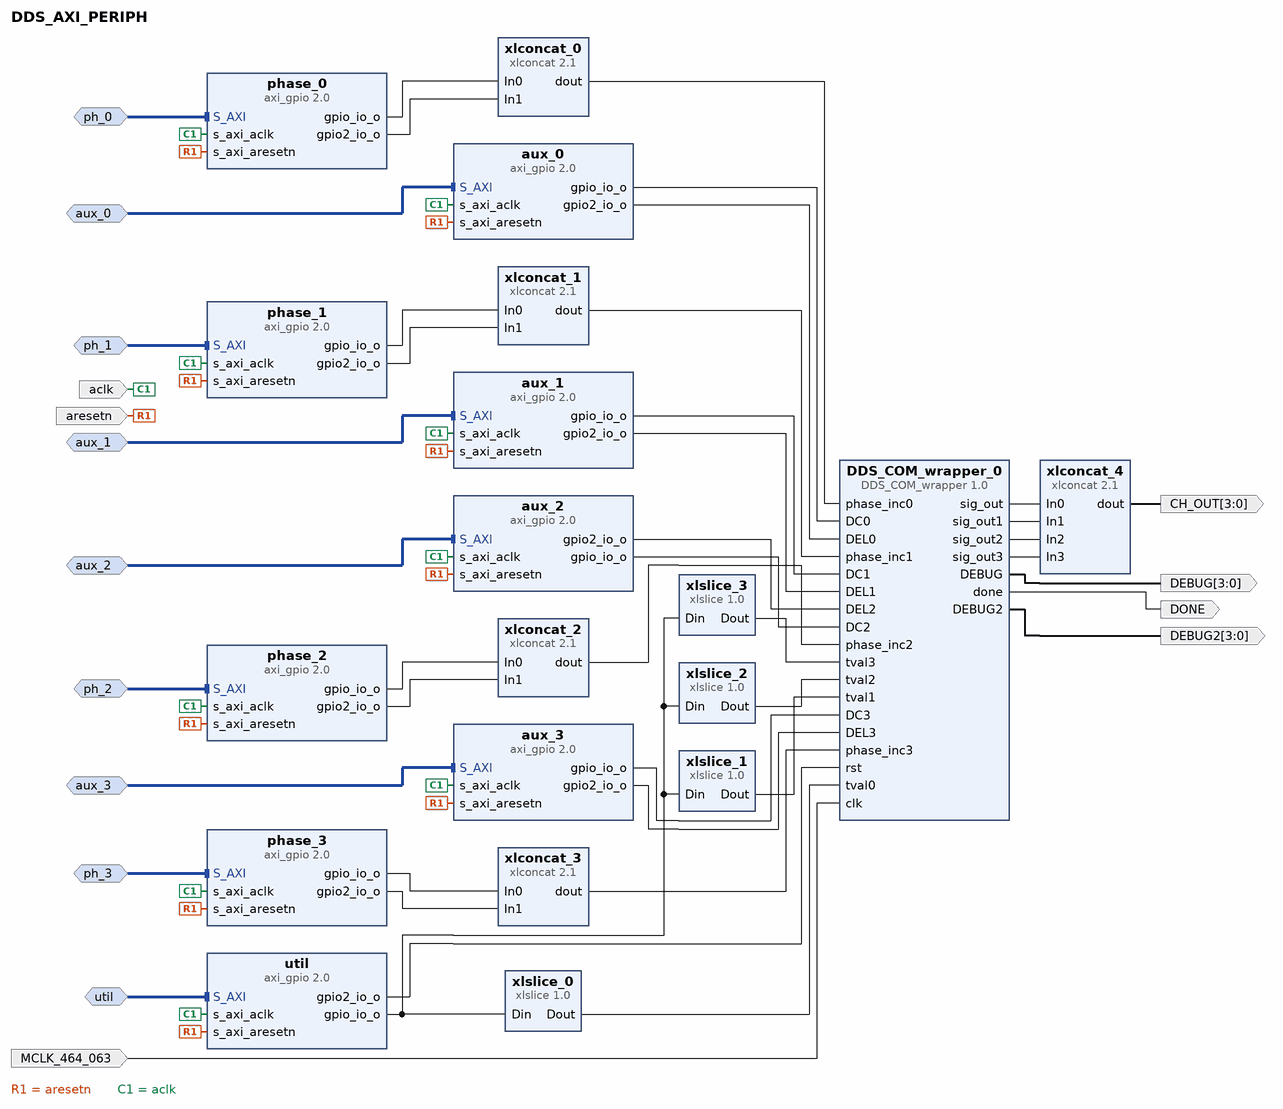
[diagram p0: block diagram of the top level]
# Vivado block design DDS_AXI_PERIPH, xc7z020clg400-1, Vivado 2019.1
create_bd_design DDS_AXI_PERIPH

create_bd_intf_port -mode Slave -vlnv xilinx.com:interface:aximm_tlm:1.0 ph_0
create_bd_intf_port -mode Slave -vlnv xilinx.com:interface:aximm_tlm:1.0 ph_1
create_bd_intf_port -mode Slave -vlnv xilinx.com:interface:aximm_tlm:1.0 ph_2
create_bd_intf_port -mode Slave -vlnv xilinx.com:interface:aximm_tlm:1.0 ph_3
create_bd_intf_port -mode Slave -vlnv xilinx.com:interface:aximm_tlm:1.0 aux_0
create_bd_intf_port -mode Slave -vlnv xilinx.com:interface:aximm_tlm:1.0 aux_1
create_bd_intf_port -mode Slave -vlnv xilinx.com:interface:aximm_tlm:1.0 aux_2
create_bd_intf_port -mode Slave -vlnv xilinx.com:interface:aximm_tlm:1.0 aux_3
create_bd_intf_port -mode Slave -vlnv xilinx.com:interface:aximm_tlm:1.0 util
create_bd_port -dir O -from 3 -to 0 CH_OUT
create_bd_port -dir O DONE
create_bd_port -dir I aresetn
create_bd_port -dir I MCLK_464_063
create_bd_port -dir I aclk
create_bd_port -dir O -from 3 -to 0 DEBUG
create_bd_port -dir O -from 3 -to 0 DEBUG2

create_bd_cell -type ip -vlnv xilinx.com:ip:axi_gpio:2.0 phase_0
set_property -dict [list \
  CONFIG.C_ALL_OUTPUTS 1 \
  CONFIG.C_ALL_OUTPUTS_2 1 \
  CONFIG.C_GPIO2_WIDTH 16 \
  CONFIG.C_IS_DUAL 1 \
] [get_bd_cells phase_0]
create_bd_cell -type ip -vlnv xilinx.com:ip:axi_gpio:2.0 phase_1
set_property -dict [list \
  CONFIG.C_ALL_OUTPUTS 1 \
  CONFIG.C_ALL_OUTPUTS_2 1 \
  CONFIG.C_GPIO2_WIDTH 16 \
  CONFIG.C_IS_DUAL 1 \
] [get_bd_cells phase_1]
create_bd_cell -type ip -vlnv xilinx.com:ip:axi_gpio:2.0 phase_2
set_property -dict [list \
  CONFIG.C_ALL_OUTPUTS 1 \
  CONFIG.C_ALL_OUTPUTS_2 1 \
  CONFIG.C_GPIO2_WIDTH 16 \
  CONFIG.C_IS_DUAL 1 \
] [get_bd_cells phase_2]
create_bd_cell -type ip -vlnv xilinx.com:ip:axi_gpio:2.0 phase_3
set_property -dict [list \
  CONFIG.C_ALL_OUTPUTS 1 \
  CONFIG.C_ALL_OUTPUTS_2 1 \
  CONFIG.C_GPIO2_WIDTH 16 \
  CONFIG.C_IS_DUAL 1 \
] [get_bd_cells phase_3]
create_bd_cell -type ip -vlnv xilinx.com:ip:xlconcat:2.1 xlconcat_0
set_property -dict {CONFIG.IN0_WIDTH 32 CONFIG.IN1_WIDTH 16} [get_bd_cells xlconcat_0]
create_bd_cell -type ip -vlnv xilinx.com:ip:xlconcat:2.1 xlconcat_1
set_property -dict {CONFIG.IN0_WIDTH 32 CONFIG.IN1_WIDTH 16} [get_bd_cells xlconcat_1]
create_bd_cell -type ip -vlnv xilinx.com:ip:xlconcat:2.1 xlconcat_2
set_property -dict {CONFIG.IN0_WIDTH 32 CONFIG.IN1_WIDTH 16} [get_bd_cells xlconcat_2]
create_bd_cell -type ip -vlnv xilinx.com:ip:xlconcat:2.1 xlconcat_3
set_property -dict {CONFIG.IN0_WIDTH 32 CONFIG.IN1_WIDTH 16} [get_bd_cells xlconcat_3]
create_bd_cell -type ip -vlnv xilinx.com:ip:axi_gpio:2.0 aux_0
set_property -dict {CONFIG.C_ALL_OUTPUTS 1 CONFIG.C_ALL_OUTPUTS_2 1 CONFIG.C_IS_DUAL 1} [get_bd_cells aux_0]
create_bd_cell -type ip -vlnv xilinx.com:ip:axi_gpio:2.0 aux_1
set_property -dict {CONFIG.C_ALL_OUTPUTS 1 CONFIG.C_ALL_OUTPUTS_2 1 CONFIG.C_IS_DUAL 1} [get_bd_cells aux_1]
create_bd_cell -type ip -vlnv xilinx.com:ip:axi_gpio:2.0 aux_2
set_property -dict {CONFIG.C_ALL_OUTPUTS 1 CONFIG.C_ALL_OUTPUTS_2 1 CONFIG.C_IS_DUAL 1} [get_bd_cells aux_2]
create_bd_cell -type ip -vlnv xilinx.com:ip:axi_gpio:2.0 aux_3
set_property -dict {CONFIG.C_ALL_OUTPUTS 1 CONFIG.C_ALL_OUTPUTS_2 1 CONFIG.C_IS_DUAL 1} [get_bd_cells aux_3]
create_bd_cell -type ip -vlnv xilinx.com:ip:axi_gpio:2.0 util
set_property -dict [list \
  CONFIG.C_ALL_OUTPUTS 1 \
  CONFIG.C_ALL_OUTPUTS_2 1 \
  CONFIG.C_GPIO2_WIDTH 1 \
  CONFIG.C_GPIO_WIDTH 4 \
  CONFIG.C_IS_DUAL 1 \
] [get_bd_cells util]
create_bd_cell -type ip -vlnv xilinx.com:ip:xlslice:1.0 xlslice_0
set_property -dict {CONFIG.DIN_FROM 0 CONFIG.DIN_TO 0 CONFIG.DIN_WIDTH 4} [get_bd_cells xlslice_0]
create_bd_cell -type ip -vlnv xilinx.com:ip:xlslice:1.0 xlslice_1
set_property -dict {CONFIG.DIN_FROM 1 CONFIG.DIN_TO 1 CONFIG.DIN_WIDTH 4 CONFIG.DOUT_WIDTH 1} [get_bd_cells xlslice_1]
create_bd_cell -type ip -vlnv xilinx.com:ip:xlslice:1.0 xlslice_2
set_property -dict {CONFIG.DIN_FROM 2 CONFIG.DIN_TO 2 CONFIG.DIN_WIDTH 4 CONFIG.DOUT_WIDTH 1} [get_bd_cells xlslice_2]
create_bd_cell -type ip -vlnv xilinx.com:ip:xlslice:1.0 xlslice_3
set_property -dict {CONFIG.DIN_FROM 3 CONFIG.DIN_TO 3 CONFIG.DIN_WIDTH 4 CONFIG.DOUT_WIDTH 1} [get_bd_cells xlslice_3]
create_bd_cell -type ip -vlnv xilinx.com:ip:xlconcat:2.1 xlconcat_4
set_property -dict {CONFIG.NUM_PORTS 4} [get_bd_cells xlconcat_4]
create_bd_cell -type ip -vlnv cri.nz:user:DDS_COM_wrapper:1.0 DDS_COM_wrapper_0

# ---- connections ----

connect_bd_intf_net -intf_net aux_1_1 [get_bd_intf_ports aux_1] [get_bd_intf_pins aux_1/S_AXI]
connect_bd_intf_net -intf_net aux_2_1 [get_bd_intf_ports aux_2] [get_bd_intf_pins aux_2/S_AXI]
connect_bd_intf_net -intf_net ph_3_1 [get_bd_intf_ports ph_3] [get_bd_intf_pins phase_3/S_AXI]
connect_bd_intf_net -intf_net ph_0_1 [get_bd_intf_ports ph_0] [get_bd_intf_pins phase_0/S_AXI]
connect_bd_intf_net -intf_net ph_2_1 [get_bd_intf_ports ph_2] [get_bd_intf_pins phase_2/S_AXI]
connect_bd_intf_net -intf_net aux_0_1 [get_bd_intf_ports aux_0] [get_bd_intf_pins aux_0/S_AXI]
connect_bd_intf_net -intf_net ph_1_1 [get_bd_intf_ports ph_1] [get_bd_intf_pins phase_1/S_AXI]
connect_bd_intf_net -intf_net aux_3_1 [get_bd_intf_ports aux_3] [get_bd_intf_pins aux_3/S_AXI]
connect_bd_intf_net [get_bd_intf_ports util] [get_bd_intf_pins util/S_AXI]
connect_bd_net [get_bd_pins phase_0/gpio_io_o] [get_bd_pins xlconcat_0/In0]
connect_bd_net [get_bd_pins phase_0/gpio2_io_o] [get_bd_pins xlconcat_0/In1]
connect_bd_net [get_bd_pins phase_1/gpio_io_o] [get_bd_pins xlconcat_1/In0]
connect_bd_net [get_bd_pins phase_1/gpio2_io_o] [get_bd_pins xlconcat_1/In1]
connect_bd_net [get_bd_pins phase_2/gpio_io_o] [get_bd_pins xlconcat_2/In0]
connect_bd_net [get_bd_pins phase_2/gpio2_io_o] [get_bd_pins xlconcat_2/In1]
connect_bd_net [get_bd_pins phase_3/gpio_io_o] [get_bd_pins xlconcat_3/In0]
connect_bd_net [get_bd_pins phase_3/gpio2_io_o] [get_bd_pins xlconcat_3/In1]
connect_bd_net [get_bd_pins xlconcat_0/dout] [get_bd_pins DDS_COM_wrapper_0/phase_inc0]
connect_bd_net [get_bd_pins xlconcat_1/dout] [get_bd_pins DDS_COM_wrapper_0/phase_inc1]
connect_bd_net [get_bd_pins xlconcat_2/dout] [get_bd_pins DDS_COM_wrapper_0/phase_inc2]
connect_bd_net [get_bd_pins xlconcat_3/dout] [get_bd_pins DDS_COM_wrapper_0/phase_inc3]
connect_bd_net [get_bd_pins aux_0/gpio_io_o] [get_bd_pins DDS_COM_wrapper_0/DC0]
connect_bd_net [get_bd_pins aux_0/gpio2_io_o] [get_bd_pins DDS_COM_wrapper_0/DEL0]
connect_bd_net [get_bd_pins aux_1/gpio_io_o] [get_bd_pins DDS_COM_wrapper_0/DC1]
connect_bd_net [get_bd_pins aux_1/gpio2_io_o] [get_bd_pins DDS_COM_wrapper_0/DEL1]
connect_bd_net [get_bd_pins aux_2/gpio2_io_o] [get_bd_pins DDS_COM_wrapper_0/DEL2]
connect_bd_net [get_bd_pins aux_2/gpio_io_o] [get_bd_pins DDS_COM_wrapper_0/DC2]
connect_bd_net [get_bd_pins aux_3/gpio_io_o] [get_bd_pins DDS_COM_wrapper_0/DC3]
connect_bd_net [get_bd_pins aux_3/gpio2_io_o] [get_bd_pins DDS_COM_wrapper_0/DEL3]
connect_bd_net -net axi_gpio_0_gpio_io_o [get_bd_pins util/gpio_io_o] \
  [get_bd_pins xlslice_0/Din] [get_bd_pins xlslice_1/Din] [get_bd_pins xlslice_2/Din] [get_bd_pins xlslice_3/Din]
connect_bd_net [get_bd_pins xlslice_0/Dout] [get_bd_pins DDS_COM_wrapper_0/tval0]
connect_bd_net [get_bd_pins xlslice_1/Dout] [get_bd_pins DDS_COM_wrapper_0/tval1]
connect_bd_net [get_bd_pins xlslice_2/Dout] [get_bd_pins DDS_COM_wrapper_0/tval2]
connect_bd_net [get_bd_pins xlslice_3/Dout] [get_bd_pins DDS_COM_wrapper_0/tval3]
connect_bd_net -net axi_gpio_0_gpio2_io_o [get_bd_pins util/gpio2_io_o] [get_bd_pins DDS_COM_wrapper_0/rst]
connect_bd_net [get_bd_pins DDS_COM_wrapper_0/sig_out] [get_bd_pins xlconcat_4/In0]
connect_bd_net [get_bd_pins DDS_COM_wrapper_0/sig_out1] [get_bd_pins xlconcat_4/In1]
connect_bd_net [get_bd_pins DDS_COM_wrapper_0/sig_out2] [get_bd_pins xlconcat_4/In2]
connect_bd_net [get_bd_pins DDS_COM_wrapper_0/sig_out3] [get_bd_pins xlconcat_4/In3]
connect_bd_net [get_bd_pins xlconcat_4/dout] [get_bd_ports CH_OUT]
connect_bd_net [get_bd_pins DDS_COM_wrapper_0/done] [get_bd_ports DONE]
connect_bd_net [get_bd_ports aresetn] \
  [get_bd_pins aux_3/s_axi_aresetn] [get_bd_pins aux_2/s_axi_aresetn] [get_bd_pins aux_1/s_axi_aresetn] \
  [get_bd_pins aux_0/s_axi_aresetn] [get_bd_pins util/s_axi_aresetn] [get_bd_pins phase_0/s_axi_aresetn] \
  [get_bd_pins phase_1/s_axi_aresetn] [get_bd_pins phase_2/s_axi_aresetn] [get_bd_pins phase_3/s_axi_aresetn]
connect_bd_net [get_bd_ports aclk] \
  [get_bd_pins phase_3/s_axi_aclk] [get_bd_pins phase_2/s_axi_aclk] [get_bd_pins phase_1/s_axi_aclk] \
  [get_bd_pins phase_0/s_axi_aclk] [get_bd_pins util/s_axi_aclk] [get_bd_pins aux_3/s_axi_aclk] \
  [get_bd_pins aux_2/s_axi_aclk] [get_bd_pins aux_1/s_axi_aclk] [get_bd_pins aux_0/s_axi_aclk]
connect_bd_net -net MCLK_464_063_1 [get_bd_ports MCLK_464_063] [get_bd_pins DDS_COM_wrapper_0/clk]
connect_bd_net [get_bd_pins DDS_COM_wrapper_0/DEBUG] [get_bd_ports DEBUG]
connect_bd_net [get_bd_pins DDS_COM_wrapper_0/DEBUG2] [get_bd_ports DEBUG2]

validate_bd_design
save_bd_design
